# Altium project 季浩原.PrjPCB
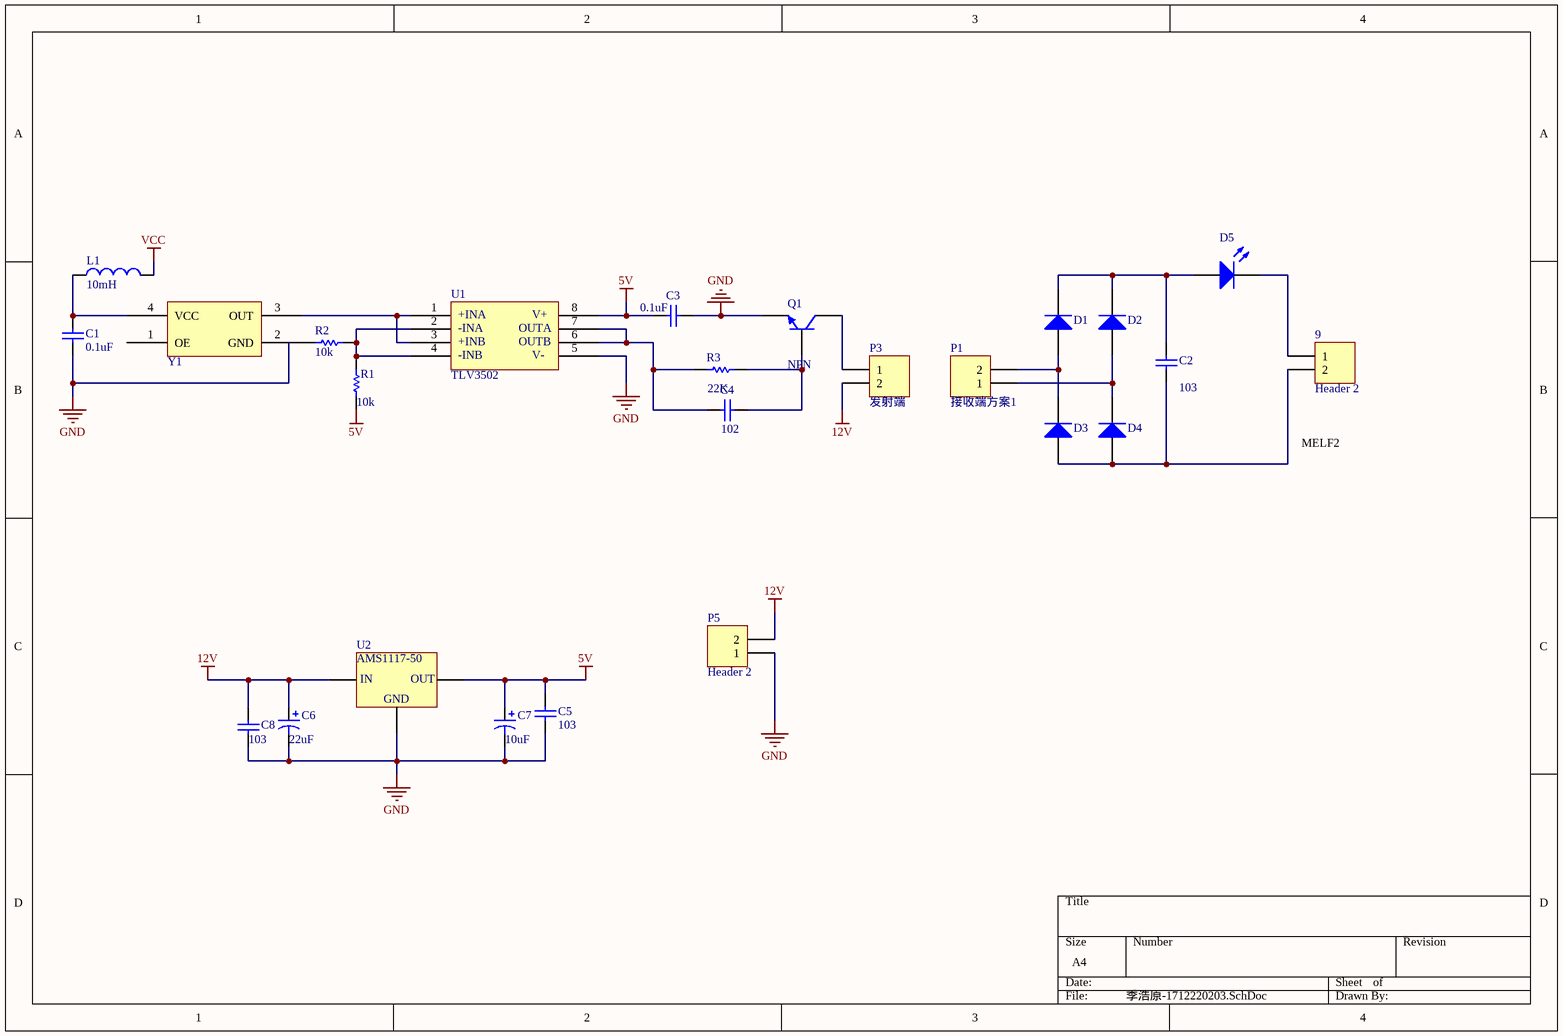
[diagram p0: 季浩原-1712220203.SchDoc]
1 sheet, 25 parts. Net scope: global (net labels, ports and power ports of the same name join across sheets).
Board file: 季浩原.PcbDoc

## Sheet 季浩原-1712220203.SchDoc
size A4

### Parts
9  Header 2  [HDR1X2]
C1  value 0.1uF  [MELF2]  (hidden comment: Cap)
C2  value 103  [MELF2]  (hidden comment: Cap)
C3  value 0.1uF  [MELF2]  (hidden comment: Cap)
C4  value 102  [MELF2]  (hidden comment: Cap)
C5  value 103  [MELF2]  (hidden comment: Cap Semi)
C6  value 22uF  [MELF2]  (hidden comment: Cap Pol1)
C7  value 10uF  [MELF2]  (hidden comment: Cap Pol1)
C8  value 103  [MELF2]  (hidden comment: Cap)
D1  Diode 1N4001  [MELF2]  (value not drawn)
D2  Diode 1N4001  [MELF2]  (value not drawn)
D3  Diode 1N4001  [MELF2]  (value not drawn)
D4  Diode 1N4001  [MELF2]  (value not drawn)
D5  LED0  [MELF2]  (value not drawn)
L1  value 10mH  [MELF2]  (hidden comment: Inductor)
P1  接收端方案1  [SMC]
P3  发射端  [SMC]
P5  Header 2  [HDR1X2]
Q1  NPN  [SOT-23]
R1  value 10k  [MELF2]  (hidden comment: Res Semi)
R2  value 10k  [MELF2]  (hidden comment: Res Semi)
R3  value 22K  [MELF2]  (hidden comment: Res Semi)
U1  TLV3502  [SO-8]
U2  AMS1117-50  [SOT-223]
Y1  Y?  [XTAL6]  (value not drawn)

### Nets
5V: C3.1 C5.2 C7.1 R1.1 U1.8 U2.10
12V: C6.1 C8.1 P3.2 P5.2 U2.11
GND: C1.2 C3.2 C5.1 C6.2 C7.2 C8.2 P5.1 Q1.3(E) U1.5 U2.12
VCC: L1.2
Net9_1: 9.1 D5.2(K)
Net9_2: 9.2 C2.1 D3.1(A) D4.1(A)
NetC1_1: C1.1 L1.1 Y1.4(VCC)
NetC2_2: C2.2 D1.2(K) D2.2(K) D5.1(A)
NetC4_1: C4.1 R3.2 U1.6 U1.7
NetC4_2: C4.2 Q1.2(B) R3.1
NetD1_1: D1.1(A) D3.2(K) P1.2
NetD2_1: D2.1(A) D4.2(K) P1.1
NetP3_1: P3.1 Q1.1(C)
NetR1_2: R1.2 R2.1 U1.2 U1.4
NetR2_2: R2.2 Y1.2(GND)
NetU1_1: U1.1 U1.3 Y1.3(OUT)

Not connected (* = marked no-connect by the designer): Y1 1(OE)

### Notes on the sheet
- MELF2
- (in symbol AMS1117-50) IN; OUT; GND
- (in symbol TLV3502) +INA; V+; -INA; OUTA; +INB; OUTB; -INB; V-

### Library data of the parts
9 P1 P3 P5 = Header 2: Header, 2-Pin; LatestRevisionDate: 17-Jul-2002; LatestRevisionNote: Re-released for DXP Platform.; Publisher: Altium Limited
C1-C4 C8 = Cap: Capacitor; Published: 8-Jun-2000; LatestRevisionDate: 17-Jul-2002; LatestRevisionNote: Re-released for DXP Platform.; PackageReference: RAD-0.3; Publisher: Altium Limited; PackageDescription: Radial Cap, Thru-Hole; 2 Leads; 0.3 in Pin Spacing
C5 = Cap Semi: Capacitor (Semiconductor SIM Model); Published: 8-Jun-2000; LatestRevisionDate: 29-May-2009; LatestRevisionNote: IPC-7351 Footprint Added.; PackageReference: C1206; Publisher: Altium Limited; PackageDescription: Chip Capacitor
C6 C7 = Cap Pol1: Polarized Capacitor (Radial); Published: 8-Jun-2000; LatestRevisionDate: 17-Jul-2002; LatestRevisionNote: Re-released for DXP Platform.; PackageReference: RB7.6-15; Publisher: Altium Limited; PackageDescription: Polarized Capacitor (Radial); 2 Leads
D1-D4 = Diode 1N4001: 1 Amp General Purpose Rectifier; Published: 8-Jun-2000; LatestRevisionDate: 17-Jul-2002; LatestRevisionNote: Re-released for DXP Platform.; DatasheetVersion: 1998; PackageVersion: Aug-1999; PackageReference: DO-41; Publisher: Altium Limited; PackageDescription: Diode, Axial; Body 5.2 x 2.7 mm (LxDia. max), Lead Dia. 0.86 mm (max); Code_JEDEC: DO-204-AL; ComponentLink1Description: Manufacturer Link; ComponentLink1URL: http://www.fairchildsemi.com/; ComponentLink2Description: Datasheet; ComponentLink2URL: http://www.fairchildsemi.com/ds/1N%2F1N4001.pdf
D5 = LED0: Typical INFRARED GaAs LED; Published: 8-Jun-2000; LatestRevisionDate: 08-Jul-2005; LatestRevisionNote: Mech Layer 1 removed.; PackageReference: LED-0; Publisher: Altium Limited; PackageDescription: LED; 2 Leads
L1 = Inductor: Code_IEC: 1005; Published: 8-Jun-2000; LatestRevisionDate: 29-May-2009; LatestRevisionNote: IPC-7351 Footprint Added.; PackageReference: 0402-A; Publisher: Altium Limited; PackageDescription: Chip Inductor; Code_JEITA: 0402
Q1 = NPN: NPN Bipolar Transistor; Published: 8-Jun-2000; LatestRevisionDate: 17-Jul-2002; LatestRevisionNote: Re-released for DXP Platform.; PackageReference: TO-226-AA; Publisher: Altium Limited; PackageDescription: TO, Flat Index; 3 In-Line, Axial Leads; Body Dia. 4.8mm; Leads 0.55 x 0.51 mm (max); Code_JEDEC: TO-226-AA
R1-R3 = Res Semi: Semiconductor Resistor; Published: 8-Jun-2000; LatestRevisionDate: 17-Jul-2002; LatestRevisionNote: Re-released for DXP Platform.; PackageReference: AXIAL-0.5; Publisher: Altium Limited; PackageDescription: Axial Device, Thru-Hole; 2 Leads; 0.5 in Pin Spacing